# Altium schematic sheet FPGA_POWER_2.SchDoc
size 420 x 297 mm; SheetNumber: 28; SheetTotal: 34
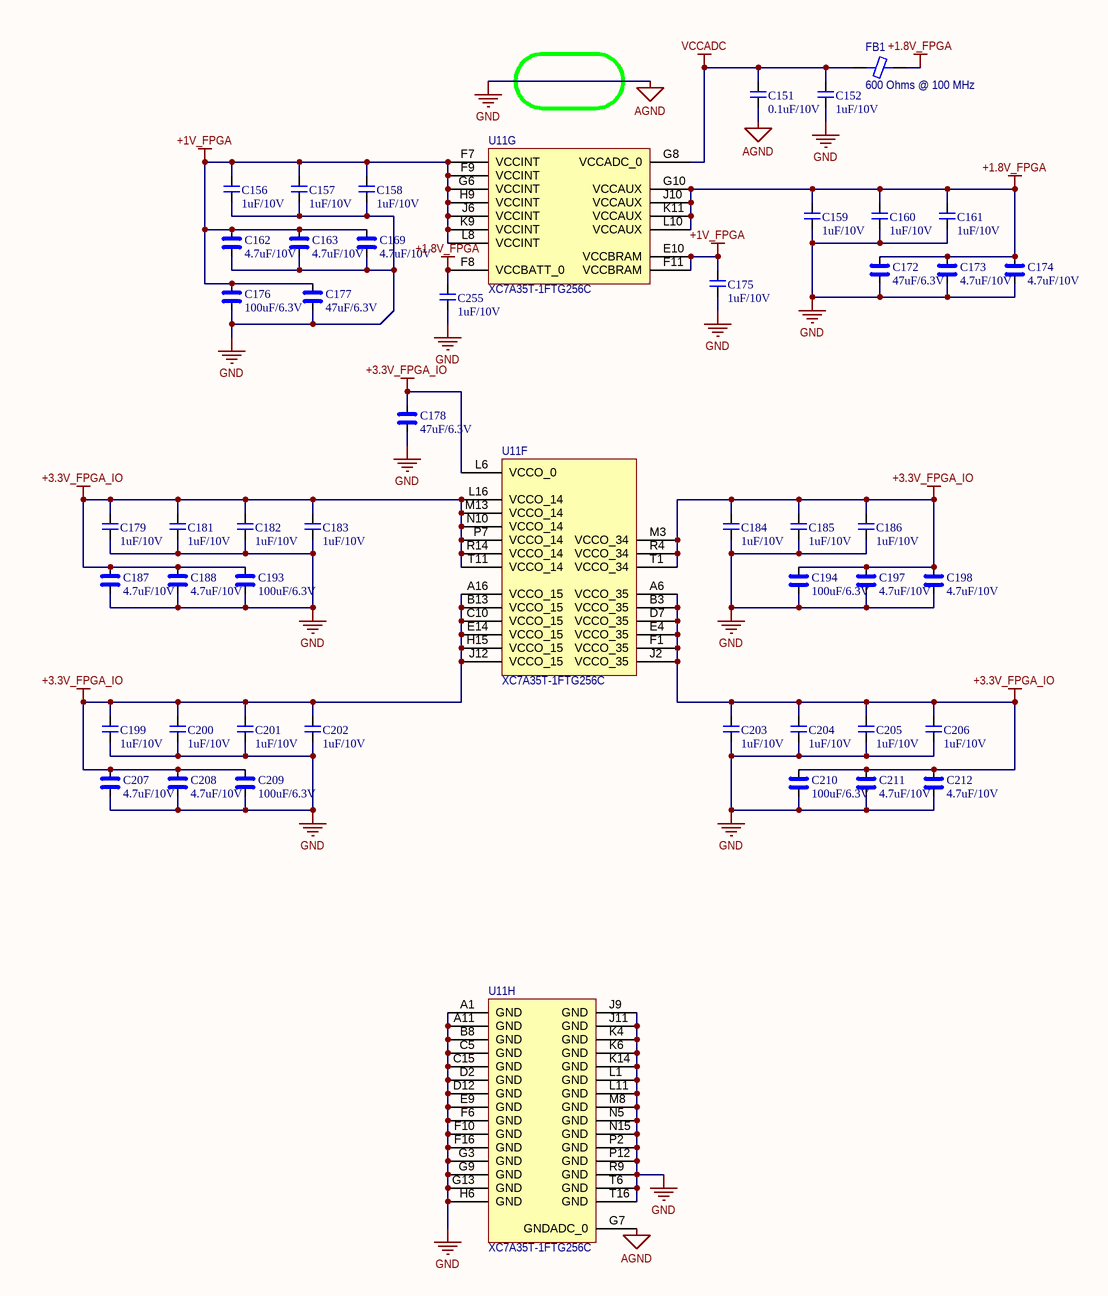
[diagram p0: FPGA_POWER_2.SchDoc]

## Parts
C151  0.1uF/10V  [CAP_C_1005X50_L]
C152  1uF/10V  [CAP_C_1005X50_L]
C156  1uF/10V  [CAP_C_1005X50_L]
C157  1uF/10V  [CAP_C_1005X50_L]
C158  1uF/10V  [CAP_C_1005X50_L]
C159  1uF/10V  [CAP_C_1005X50_L]
C160  1uF/10V  [CAP_C_1005X50_L]
C161  1uF/10V  [CAP_C_1005X50_L]
C162  4.7uF/10V  [CAP_C_1005X50_L]
C163  4.7uF/10V  [CAP_C_1005X50_L]
C169  4.7uF/10V  [CAP_C_1005X50_L]
C172  47uF/6.3V  [CAP_C_1608X80]
C173  4.7uF/10V  [CAP_C_1005X50_L]
C174  4.7uF/10V  [CAP_C_1005X50_L]
C175  1uF/10V  [CAP_C_1005X50_L]
C176  100uF/6.3V  [CAP_C_2012X110]
C177  47uF/6.3V  [CAP_C_1608X80]
C178  47uF/6.3V  [CAP_C_1608X80]
C179  1uF/10V  [CAP_C_1005X50_L]
C181  1uF/10V  [CAP_C_1005X50_L]
C182  1uF/10V  [CAP_C_1005X50_L]
C183  1uF/10V  [CAP_C_1005X50_L]
C184  1uF/10V  [CAP_C_1005X50_L]
C185  1uF/10V  [CAP_C_1005X50_L]
C186  1uF/10V  [CAP_C_1005X50_L]
C187  4.7uF/10V  [CAP_C_1005X50_L]
C188  4.7uF/10V  [CAP_C_1005X50_L]
C193  100uF/6.3V  [CAP_C_2012X110]
C194  100uF/6.3V  [CAP_C_2012X110]
C197  4.7uF/10V  [CAP_C_1005X50_L]
C198  4.7uF/10V  [CAP_C_1005X50_L]
C199  1uF/10V  [CAP_C_1005X50_L]
C200  1uF/10V  [CAP_C_1005X50_L]
C201  1uF/10V  [CAP_C_1005X50_L]
C202  1uF/10V  [CAP_C_1005X50_L]
C203  1uF/10V  [CAP_C_1005X50_L]
C204  1uF/10V  [CAP_C_1005X50_L]
C205  1uF/10V  [CAP_C_1005X50_L]
C206  1uF/10V  [CAP_C_1005X50_L]
C207  4.7uF/10V  [CAP_C_1005X50_L]
C208  4.7uF/10V  [CAP_C_1005X50_L]
C209  100uF/6.3V  [CAP_C_2012X110]
C210  100uF/6.3V  [CAP_C_2012X110]
C211  4.7uF/10V  [CAP_C_1005X50_L]
C212  4.7uF/10V  [CAP_C_1005X50_L]
C255  1uF/10V  [CAP_C_1005X50_L]
FB1  600 Ohms @ 100 MHz  [IND_C_1608X60]
U11  XC7A35T-1FTG256C  [FTG256]  (parts F,G,H of 8)

## Nets
+1.8V_FPGA: C159.1 C160.1 C161.1 C172.1 C173.1 C174.1 C255.1 FB1.2 U11.F8(VCCBATT_0) U11.G10(VCCAUX) U11.J10(VCCAUX) U11.K11(VCCAUX) U11.L10(VCCAUX)
+1V_FPGA: C156.1 C157.1 C158.1 C162.1 C163.1 C169.1 C175.1 C176.1 C177.1 U11.E10(VCCBRAM) U11.F7(VCCINT) U11.F9(VCCINT) U11.F11(VCCBRAM) U11.G6(VCCINT) U11.H9(VCCINT) U11.J6(VCCINT) U11.K9(VCCINT) U11.L8(VCCINT)
+3.3V_FPGA_IO: C178.1 C179.1 C181.1 C182.1 C183.1 C184.1 C185.1 C186.1 C187.1 C188.1 C193.1 C194.1 C197.1 C198.1 C199.1 C200.1 C201.1 C202.1 C203.1 C204.1 C205.1 C206.1 C207.1 C208.1 C209.1 C210.1 C211.1 C212.1 U11.A6(VCCO_35) U11.A16(VCCO_15) U11.B3(VCCO_35) U11.B13(VCCO_15) U11.C10(VCCO_15) U11.D7(VCCO_35) U11.E4(VCCO_35) U11.E14(VCCO_15) U11.F1(VCCO_35) U11.H15(VCCO_15) U11.J2(VCCO_35) U11.J12(VCCO_15) U11.L6(VCCO_0) U11.L16(VCCO_14) U11.M3(VCCO_34) U11.M13(VCCO_14) U11.N10(VCCO_14) U11.P7(VCCO_14) U11.R4(VCCO_34) U11.R14(VCCO_14) U11.T1(VCCO_34) U11.T11(VCCO_14)
AGND: C151.2 C152.2 C156.2 C157.2 C158.2 C159.2 C160.2 C161.2 C162.2 C163.2 C169.2 C172.2 C173.2 C174.2 C175.2 C176.2 C177.2 C178.2 C179.2 C181.2 C182.2 C183.2 C184.2 C185.2 C186.2 C187.2 C188.2 C193.2 C194.2 C197.2 C198.2 C199.2 C200.2 C201.2 C202.2 C203.2 C204.2 C205.2 C206.2 C207.2 C208.2 C209.2 C210.2 C211.2 C212.2 C255.2 U11.A1(GND) U11.A11(GND) U11.B8(GND) U11.C5(GND) U11.C15(GND) U11.D2(GND) U11.D12(GND) U11.E9(GND) U11.F6(GND) U11.F10(GND) U11.F16(GND) U11.G3(GND) U11.G7(GNDADC_0) U11.G9(GND) U11.G13(GND) U11.H6(GND) U11.J9(GND) U11.J11(GND) U11.K4(GND) U11.K6(GND) U11.K14(GND) U11.L1(GND) U11.L11(GND) U11.M8(GND) U11.N5(GND) U11.N15(GND) U11.P2(GND) U11.P12(GND) U11.R9(GND) U11.T6(GND) U11.T16(GND)  [also labelled GND]
VCCADC: C151.1 C152.1 FB1.1 U11.G8(VCCADC_0)

## Notes on the sheet
- Project:
- Sub-system:
- Design by:
- Sheet title:
- Sheet
- of
- Checked by:
- Approved by:
- Revision:
- Document No:
- Size:
- Date:
- A3

## Library data of the parts
C151 C152 C156-C161 C175 C179 C181-C186 C199-C206 C255 = _CAP_C_2: CAP
C162 C163 C169 C172-C174 C176-C178 C187 C188 C193 C194 C197 C198 C207-C212 = _CAP_C_High_2: CAP
FB1 = BLM18AG601SN1D: FERRITE BEAD 600 OHM 0603 1LN; Manufacturer: Murata Electronics; Current Rating (Max): 500mA; DC Resistance (DCR) (Max): 380mOhm; Number of Lines: 1; Part Number: BLM18AG601SN1D; ComponentLink1Description: Datasheet; ComponentLink1URL: https://www.murata.com/en-us/products/productdata/8796738650142/ENFA0003.pdf; ComponentLink2Description: DigiKey Link; ComponentLink2URL: https://www.digikey.com/en/products/detail/murata-electronics/BLM18AG601SN1D/584225; Device Package: 0603 (1608 Metric); Height (Max): 0.037" (0.95mm); Impedance @ Frequency: 600 Ohms @ 100 MHz; LastUpdated: 7/10/2022 9:43:27 AM; Lifecycle Status: Active; Minimum Order: 1; Mounting Type: Surface Mount; Operating Temperature: -55°C ~ 125°C; Package / Case: 0603 (1608 Metric); Packaging: TapeAndReel; PartId: 848; Part Status: Active; Price: 0.02; Series: EMIFIL®, BLM18; Size / Dimension: 0.063" L x 0.032" W (1.60mm x 0.80mm); Supplier 1: DigiKey; Supplier Part Number 1: 490-1014-1-ND; Value: 600 Ohms @ 100 MHz
U11 = CMP-0383-00028-1: Artix-7 FPGA, 170 User I/Os, 0 GTP, 256-Ball BGA, Speed Grade 1, Commercial Grade, Pb-Free; Manufacturer: Xilinx; Speed Grades: 1; Total Block RAM: 1800 Kb; CMTs: 5; GTP: 0; Available User I/O: 170; Logic Cells: 33280; ComponentLink2Description: Datasheet; ComponentLink2URL: http://www.xilinx.com/support/documentation/data_sheets/ds180_7Series_Overview.pdf; ComponentLink1Description: Manufacturer URL; Operating Temperature Range: Commercial; PackageVersion: Rev. 1.11; ComponentLink4URL: http://www.xilinx.com/support/documentation/user_guides/ug475_7Series_Pkg_Pinout.pdf; ComponentLink4Description: Package Specification; PackageDescription: 256-Ball Wire-Bond Fine-Pitch Thin BGA, Body 17 x 17 mm, Pitch 1 mm; Mounting Technology: Surface Mount; ComponentLink1URL: http://www.xilinx.com/; Maximum Distributed RAM: 400 Kb; PackageReference: FTG-256; DatasheetVersion: Rev. 1.15; ComponentLink3Description: Pinout; PartNumber: XC7A35T-1FTG256C; ComponentLink3URL: http://www.xilinx.com/support/documentation/user_guides/ug475_7Series_Pkg_Pinout.pdf